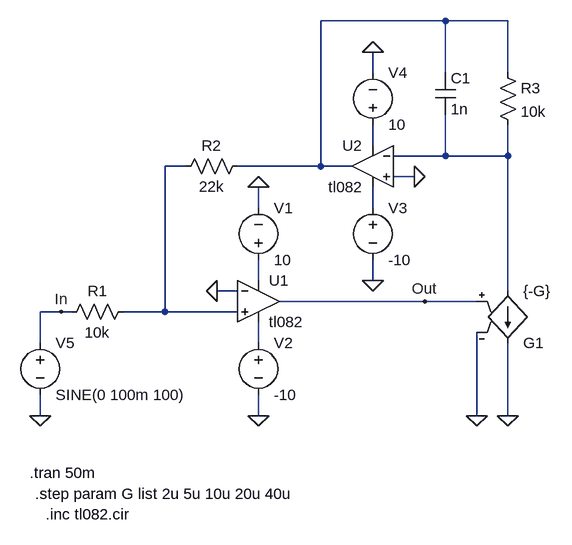
[diagram p0: schematic digitalControlledAmplifier.asc]
digitalControlledAmplifier.asc, the LTspice schematic file:
Version 4
SHEET 1 2692 856
WIRE 592 -32 400 -32
WIRE 688 -32 592 -32
WIRE 480 48 480 16
WIRE 592 48 592 -32
WIRE 688 48 688 -32
WIRE 480 160 480 128
WIRE 592 176 592 112
WIRE 592 176 512 176
WIRE 688 176 688 128
WIRE 688 176 592 176
WIRE 192 192 160 192
WIRE 400 192 400 -32
WIRE 400 192 272 192
WIRE 448 192 400 192
WIRE 544 208 512 208
WIRE 304 256 304 224
WIRE 480 256 480 224
WIRE 304 368 304 336
WIRE 480 368 480 336
WIRE 272 384 240 384
WIRE 688 384 688 176
WIRE 560 400 336 400
WIRE 640 400 560 400
WIRE 0 416 -32 416
WIRE 16 416 0 416
WIRE 160 416 160 192
WIRE 160 416 96 416
WIRE 272 416 160 416
WIRE -32 464 -32 416
WIRE 304 464 304 432
WIRE -32 576 -32 544
WIRE 304 576 304 544
WIRE 640 576 640 448
WIRE 688 576 688 464
FLAG 304 224 0
FLAG 304 576 0
FLAG 480 368 0
FLAG 480 16 0
FLAG 240 384 0
FLAG -32 576 0
FLAG 688 576 0
FLAG 640 576 0
FLAG 544 208 0
FLAG 560 400 Out
FLAG 0 416 In
SYMBOL res 112 400 R90
WINDOW 0 0 56 VBottom 2
WINDOW 3 32 56 VTop 2
SYMATTR InstName R1
SYMATTR Value 10k
SYMBOL res 288 176 R90
WINDOW 0 0 56 VBottom 2
WINDOW 3 32 56 VTop 2
SYMATTR InstName R2
SYMATTR Value 22k
SYMBOL voltage 304 352 M180
WINDOW 0 24 96 Left 2
WINDOW 3 24 16 Left 2
SYMATTR InstName V1
SYMATTR Value 10
SYMBOL voltage 304 448 R0
SYMATTR InstName V2
SYMATTR Value -10
SYMBOL voltage 480 240 R0
SYMATTR InstName V3
SYMATTR Value -10
SYMBOL voltage 480 144 M180
WINDOW 0 24 96 Left 2
WINDOW 3 24 16 Left 2
SYMATTR InstName V4
SYMATTR Value 10
SYMBOL voltage -32 448 R0
SYMATTR InstName V5
SYMATTR Value SINE(0 100m 100)
SYMBOL cap 576 48 R0
SYMATTR InstName C1
SYMATTR Value 1n
SYMBOL res 672 32 R0
SYMATTR InstName R3
SYMATTR Value 10k
SYMBOL g2 688 480 M180
SYMATTR InstName G1
SYMATTR Value {-G}
SYMBOL opamp2 304 336 R0
SYMATTR InstName U1
SYMATTR Value tl082
SYMBOL opamp2 480 128 M0
SYMATTR InstName U2
SYMATTR Value tl082
TEXT -48 664 Left 2 !.tran 50m
TEXT -40 696 Left 2 !.step param G list 2u 5u 10u 20u 40u
TEXT -24 728 Left 2 !.inc tl082.cir

The netlist it stands for:
* digitalControlledAmplifier.asc
R1 N004 In 10k
R2 N001 N004 22k
V1 N006 0 10
V2 N007 0 -10
V3 N005 0 -10
V4 N002 0 10
V5 In 0 SINE(0 100m 100)
C1 N001 N003 1n
R3 N001 N003 10k
G1 N003 0 Out 0 {-G}
XU1 N004 0 N006 N007 Out tl082  ; pins In+ In- V+ V- OUT
XU2 0 N003 N002 N005 N001 tl082  ; pins In+ In- V+ V- OUT
.tran 50m
.step param G list 2u 5u 10u 20u 40u
.inc tl082.cir
.backanno
.end